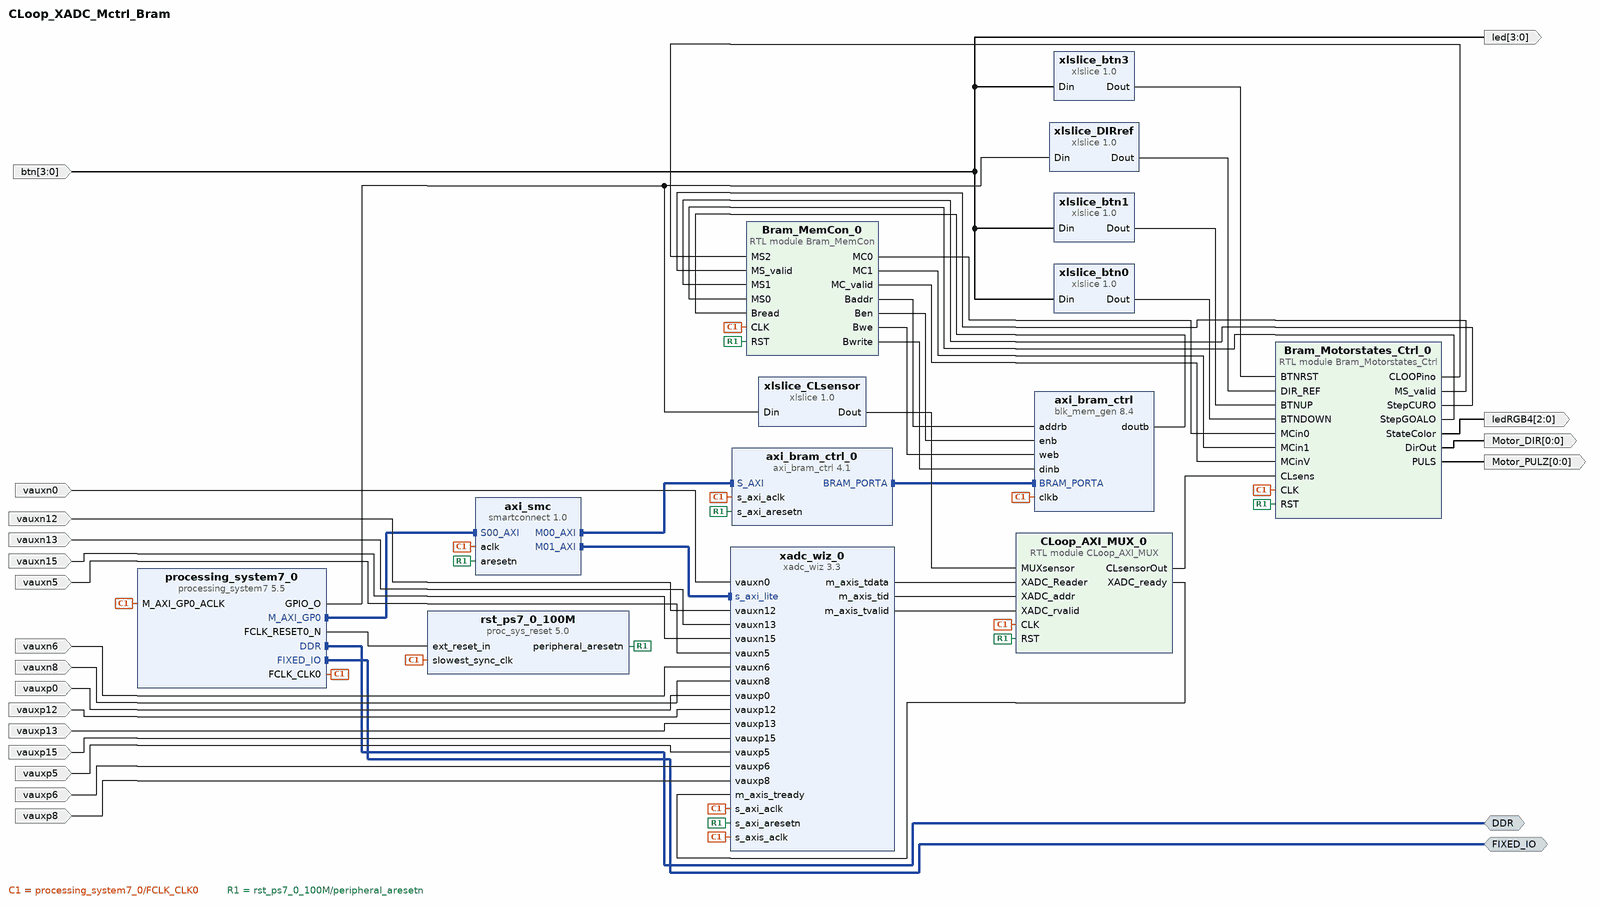
[diagram p0: block diagram of the top level]
# Vivado block design CLoop_XADC_Mctrl_Bram, xc7z020clg400-1, Vivado 2024.1
create_bd_design CLoop_XADC_Mctrl_Bram

create_bd_intf_port -mode Master -vlnv xilinx.com:interface:ddrx_rtl:1.0 DDR
create_bd_intf_port -mode Master -vlnv xilinx.com:display_processing_system7:fixedio_rtl:1.0 FIXED_IO
create_bd_port -dir O -from 0 -to 0 Motor_DIR
create_bd_port -dir O -from 0 -to 0 Motor_PULZ
create_bd_port -dir I -from 3 -to 0 btn
create_bd_port -dir O -from 3 -to 0 led
create_bd_port -dir O -from 2 -to 0 ledRGB4
create_bd_port -dir I vauxn12
create_bd_port -dir I vauxn13
create_bd_port -dir I vauxn5
create_bd_port -dir I vauxp12
create_bd_port -dir I vauxp13
create_bd_port -dir I vauxp5
create_bd_port -dir I vauxn0
create_bd_port -dir I vauxn15
create_bd_port -dir I vauxn6
create_bd_port -dir I vauxn8
create_bd_port -dir I vauxp0
create_bd_port -dir I vauxp15
create_bd_port -dir I vauxp6
create_bd_port -dir I vauxp8

create_bd_cell -type module -reference Bram_MemCon Bram_MemCon_0
create_bd_cell -type module -reference Bram_Motorstates_Ctrl Bram_Motorstates_Ctrl_0
create_bd_cell -type ip -vlnv xilinx.com:ip:blk_mem_gen:8.4 axi_bram_ctrl
set_property -dict {CONFIG.Assume_Synchronous_Clk true CONFIG.Memory_Type True_Dual_Port_RAM} [get_bd_cells axi_bram_ctrl]
create_bd_cell -type ip -vlnv xilinx.com:ip:axi_bram_ctrl:4.1 axi_bram_ctrl_0
set_property -dict [list \
  CONFIG.DATA_WIDTH 32 \
  CONFIG.RD_CMD_OPTIMIZATION 0 \
  CONFIG.SINGLE_PORT_BRAM 1 \
  CONFIG.USE_ECC 0 \
] [get_bd_cells axi_bram_ctrl_0]
create_bd_cell -type ip -vlnv xilinx.com:ip:smartconnect:1.0 axi_smc
set_property -dict {CONFIG.NUM_MI 2 CONFIG.NUM_SI 1} [get_bd_cells axi_smc]
create_bd_cell -type ip -vlnv xilinx.com:ip:processing_system7:5.5 processing_system7_0
set_property -dict [list \
  CONFIG.PCW_APU_PERIPHERAL_FREQMHZ 650 \
  CONFIG.PCW_CRYSTAL_PERIPHERAL_FREQMHZ 50 \
  CONFIG.PCW_ENET0_ENET0_IO {MIO 16 .. 27} \
  CONFIG.PCW_ENET0_GRP_MDIO_ENABLE 1 \
  CONFIG.PCW_ENET0_GRP_MDIO_IO {MIO 52 .. 53} \
  CONFIG.PCW_ENET0_PERIPHERAL_ENABLE 1 \
  CONFIG.PCW_ENET0_RESET_ENABLE 1 \
  CONFIG.PCW_ENET0_RESET_IO {MIO 9} \
  CONFIG.PCW_ENET_RESET_ENABLE 1 \
  CONFIG.PCW_ENET_RESET_SELECT {Share reset pin} \
  CONFIG.PCW_FPGA0_PERIPHERAL_FREQMHZ 100 \
  CONFIG.PCW_FPGA1_PERIPHERAL_FREQMHZ 50 \
  CONFIG.PCW_GPIO_EMIO_GPIO_ENABLE 1 \
  CONFIG.PCW_GPIO_EMIO_GPIO_IO 5 \
  CONFIG.PCW_GPIO_EMIO_GPIO_WIDTH 5 \
  CONFIG.PCW_GPIO_MIO_GPIO_ENABLE 1 \
  CONFIG.PCW_GPIO_MIO_GPIO_IO MIO \
  CONFIG.PCW_I2C_RESET_ENABLE 1 \
  CONFIG.PCW_M_AXI_GP0_FREQMHZ 10 \
  CONFIG.PCW_PERIPHERAL_BOARD_PRESET None \
  CONFIG.PCW_PRESET_BANK1_VOLTAGE {LVCMOS 1.8V} \
  CONFIG.PCW_QSPI_GRP_FBCLK_ENABLE 1 \
  CONFIG.PCW_QSPI_GRP_FBCLK_IO {MIO 8} \
  CONFIG.PCW_QSPI_GRP_SINGLE_SS_ENABLE 1 \
  CONFIG.PCW_QSPI_GRP_SINGLE_SS_IO {MIO 1 .. 6} \
  CONFIG.PCW_QSPI_PERIPHERAL_ENABLE 1 \
  CONFIG.PCW_QSPI_QSPI_IO {MIO 1 .. 6} \
  CONFIG.PCW_SD0_GRP_CD_ENABLE 1 \
  CONFIG.PCW_SD0_GRP_CD_IO {MIO 47} \
  CONFIG.PCW_SD0_GRP_WP_ENABLE 0 \
  CONFIG.PCW_SD0_PERIPHERAL_ENABLE 1 \
  CONFIG.PCW_SD0_SD0_IO {MIO 40 .. 45} \
  CONFIG.PCW_SDIO_PERIPHERAL_FREQMHZ 50 \
  CONFIG.PCW_SINGLE_QSPI_DATA_MODE x4 \
  CONFIG.PCW_UART0_PERIPHERAL_ENABLE 1 \
  CONFIG.PCW_UART0_UART0_IO {MIO 14 .. 15} \
  CONFIG.PCW_UART1_PERIPHERAL_ENABLE 0 \
  CONFIG.PCW_UART_PERIPHERAL_FREQMHZ 100 \
  CONFIG.PCW_UIPARAM_DDR_BUS_WIDTH {16 Bit} \
  CONFIG.PCW_UIPARAM_DDR_FREQ_MHZ 525 \
  CONFIG.PCW_UIPARAM_DDR_PARTNO {MT41J256M16 RE-125} \
  CONFIG.PCW_USB0_PERIPHERAL_ENABLE 1 \
  CONFIG.PCW_USB0_RESET_ENABLE 1 \
  CONFIG.PCW_USB0_RESET_IO {MIO 46} \
  CONFIG.PCW_USB0_USB0_IO {MIO 28 .. 39} \
  CONFIG.PCW_USB_RESET_ENABLE 1 \
  CONFIG.PCW_USB_RESET_SELECT {Share reset pin} \
] [get_bd_cells processing_system7_0]
# 496 more settings of processing_system7_0 are not shown: defaults, MIO pin electricals, DDR timing, and values the tool derives
create_bd_cell -type ip -vlnv xilinx.com:ip:proc_sys_reset:5.0 rst_ps7_0_100M
create_bd_cell -type ip -vlnv xilinx.com:ip:xlslice:1.0 xlslice_CLsensor
set_property -dict {CONFIG.DIN_FROM 4 CONFIG.DIN_TO 1 CONFIG.DIN_WIDTH 5} [get_bd_cells xlslice_CLsensor]
create_bd_cell -type ip -vlnv xilinx.com:ip:xlslice:1.0 xlslice_DIRref
set_property -dict {CONFIG.DIN_FROM 0 CONFIG.DIN_WIDTH 5} [get_bd_cells xlslice_DIRref]
create_bd_cell -type ip -vlnv xilinx.com:ip:xlslice:1.0 xlslice_btn0
set_property -dict {CONFIG.DIN_WIDTH 4} [get_bd_cells xlslice_btn0]
create_bd_cell -type ip -vlnv xilinx.com:ip:xlslice:1.0 xlslice_btn1
set_property -dict {CONFIG.DIN_FROM 1 CONFIG.DIN_TO 1 CONFIG.DIN_WIDTH 4} [get_bd_cells xlslice_btn1]
create_bd_cell -type ip -vlnv xilinx.com:ip:xlslice:1.0 xlslice_btn3
set_property -dict {CONFIG.DIN_FROM 3 CONFIG.DIN_TO 3 CONFIG.DIN_WIDTH 4} [get_bd_cells xlslice_btn3]
create_bd_cell -type module -reference CLoop_AXI_MUX CLoop_AXI_MUX_0
create_bd_cell -type ip -vlnv xilinx.com:ip:xadc_wiz:3.3 xadc_wiz_0
set_property -dict [list \
  CONFIG.CHANNEL_ENABLE_TEMPERATURE true \
  CONFIG.CHANNEL_ENABLE_VAUXP0_VAUXN0 true \
  CONFIG.CHANNEL_ENABLE_VAUXP12_VAUXN12 true \
  CONFIG.CHANNEL_ENABLE_VAUXP13_VAUXN13 true \
  CONFIG.CHANNEL_ENABLE_VAUXP15_VAUXN15 true \
  CONFIG.CHANNEL_ENABLE_VAUXP1_VAUXN1 false \
  CONFIG.CHANNEL_ENABLE_VAUXP5_VAUXN5 true \
  CONFIG.CHANNEL_ENABLE_VAUXP6_VAUXN6 true \
  CONFIG.CHANNEL_ENABLE_VAUXP8_VAUXN8 true \
  CONFIG.CHANNEL_ENABLE_VP_VN false \
  CONFIG.ENABLE_AXI4STREAM true \
  CONFIG.ENABLE_VCCDDRO_ALARM false \
  CONFIG.ENABLE_VCCPAUX_ALARM false \
  CONFIG.ENABLE_VCCPINT_ALARM false \
  CONFIG.EXTERNAL_MUX_CHANNEL VP_VN \
  CONFIG.OT_ALARM false \
  CONFIG.SEQUENCER_MODE Continuous \
  CONFIG.SINGLE_CHANNEL_SELECTION TEMPERATURE \
  CONFIG.USER_TEMP_ALARM false \
  CONFIG.VCCAUX_ALARM false \
  CONFIG.VCCINT_ALARM false \
  CONFIG.XADC_STARUP_SELECTION channel_sequencer \
] [get_bd_cells xadc_wiz_0]

# ---- connections ----

connect_bd_intf_net [get_bd_intf_pins axi_bram_ctrl/BRAM_PORTA] [get_bd_intf_pins axi_bram_ctrl_0/BRAM_PORTA]
connect_bd_intf_net [get_bd_intf_pins axi_smc/M00_AXI] [get_bd_intf_pins axi_bram_ctrl_0/S_AXI]
connect_bd_intf_net [get_bd_intf_pins axi_smc/M01_AXI] [get_bd_intf_pins xadc_wiz_0/s_axi_lite]
connect_bd_intf_net [get_bd_intf_ports DDR] [get_bd_intf_pins processing_system7_0/DDR]
connect_bd_intf_net [get_bd_intf_ports FIXED_IO] [get_bd_intf_pins processing_system7_0/FIXED_IO]
connect_bd_intf_net [get_bd_intf_pins processing_system7_0/M_AXI_GP0] [get_bd_intf_pins axi_smc/S00_AXI]
connect_bd_net [get_bd_pins Bram_MemCon_0/Baddr] [get_bd_pins axi_bram_ctrl/addrb]
connect_bd_net [get_bd_pins Bram_MemCon_0/Ben] [get_bd_pins axi_bram_ctrl/enb]
connect_bd_net [get_bd_pins Bram_MemCon_0/Bwe] [get_bd_pins axi_bram_ctrl/web]
connect_bd_net [get_bd_pins Bram_MemCon_0/Bwrite] [get_bd_pins axi_bram_ctrl/dinb]
connect_bd_net [get_bd_pins Bram_MemCon_0/MC0] [get_bd_pins Bram_Motorstates_Ctrl_0/MCin0]
connect_bd_net [get_bd_pins Bram_MemCon_0/MC1] [get_bd_pins Bram_Motorstates_Ctrl_0/MCin1]
connect_bd_net [get_bd_pins Bram_MemCon_0/MC_valid] [get_bd_pins Bram_Motorstates_Ctrl_0/MCinV]
connect_bd_net [get_bd_pins Bram_Motorstates_Ctrl_0/CLOOPino] [get_bd_pins Bram_MemCon_0/MS2]
connect_bd_net [get_bd_pins Bram_Motorstates_Ctrl_0/DirOut] [get_bd_ports Motor_DIR]
connect_bd_net [get_bd_pins Bram_Motorstates_Ctrl_0/MS_valid] [get_bd_pins Bram_MemCon_0/MS_valid]
connect_bd_net [get_bd_pins Bram_Motorstates_Ctrl_0/PULS] [get_bd_ports Motor_PULZ]
connect_bd_net [get_bd_pins Bram_Motorstates_Ctrl_0/StateColor] [get_bd_ports ledRGB4]
connect_bd_net [get_bd_pins Bram_Motorstates_Ctrl_0/StepCURO] [get_bd_pins Bram_MemCon_0/MS1]
connect_bd_net [get_bd_pins Bram_Motorstates_Ctrl_0/StepGOALO] [get_bd_pins Bram_MemCon_0/MS0]
connect_bd_net [get_bd_pins CLoop_AXI_MUX_0/CLsensorOut] [get_bd_pins Bram_Motorstates_Ctrl_0/CLsens]
connect_bd_net [get_bd_pins CLoop_AXI_MUX_0/XADC_ready] [get_bd_pins xadc_wiz_0/m_axis_tready]
connect_bd_net [get_bd_pins axi_bram_ctrl/doutb] [get_bd_pins Bram_MemCon_0/Bread]
connect_bd_net [get_bd_ports btn] [get_bd_pins xlslice_btn0/Din] [get_bd_pins xlslice_btn1/Din] [get_bd_ports led] [get_bd_pins xlslice_btn3/Din]
connect_bd_net [get_bd_pins processing_system7_0/FCLK_CLK0] \
  [get_bd_pins axi_bram_ctrl_0/s_axi_aclk] [get_bd_pins axi_smc/aclk] [get_bd_pins axi_bram_ctrl/clkb] \
  [get_bd_pins processing_system7_0/M_AXI_GP0_ACLK] [get_bd_pins rst_ps7_0_100M/slowest_sync_clk] \
  [get_bd_pins Bram_MemCon_0/CLK] [get_bd_pins Bram_Motorstates_Ctrl_0/CLK] [get_bd_pins xadc_wiz_0/s_axis_aclk] \
  [get_bd_pins xadc_wiz_0/s_axi_aclk] [get_bd_pins CLoop_AXI_MUX_0/CLK]
connect_bd_net [get_bd_pins processing_system7_0/FCLK_RESET0_N] [get_bd_pins rst_ps7_0_100M/ext_reset_in]
connect_bd_net [get_bd_pins processing_system7_0/GPIO_O] [get_bd_pins xlslice_DIRref/Din] [get_bd_pins xlslice_CLsensor/Din]
connect_bd_net [get_bd_pins rst_ps7_0_100M/peripheral_aresetn] \
  [get_bd_pins axi_bram_ctrl_0/s_axi_aresetn] [get_bd_pins axi_smc/aresetn] [get_bd_pins Bram_MemCon_0/RST] \
  [get_bd_pins Bram_Motorstates_Ctrl_0/RST] [get_bd_pins xadc_wiz_0/s_axi_aresetn] [get_bd_pins CLoop_AXI_MUX_0/RST]
connect_bd_net -net vauxn0_1 [get_bd_ports vauxn0] [get_bd_pins xadc_wiz_0/vauxn0]
connect_bd_net -net vauxn12_1 [get_bd_ports vauxn12] [get_bd_pins xadc_wiz_0/vauxn12]
connect_bd_net -net vauxn13_1 [get_bd_ports vauxn13] [get_bd_pins xadc_wiz_0/vauxn13]
connect_bd_net -net vauxn15_1 [get_bd_ports vauxn15] [get_bd_pins xadc_wiz_0/vauxn15]
connect_bd_net -net vauxn5_1 [get_bd_ports vauxn5] [get_bd_pins xadc_wiz_0/vauxn5]
connect_bd_net -net vauxn6_1 [get_bd_ports vauxn6] [get_bd_pins xadc_wiz_0/vauxn6]
connect_bd_net -net vauxn8_1 [get_bd_ports vauxn8] [get_bd_pins xadc_wiz_0/vauxn8]
connect_bd_net -net vauxp0_1 [get_bd_ports vauxp0] [get_bd_pins xadc_wiz_0/vauxp0]
connect_bd_net -net vauxp12_1 [get_bd_ports vauxp12] [get_bd_pins xadc_wiz_0/vauxp12]
connect_bd_net -net vauxp13_1 [get_bd_ports vauxp13] [get_bd_pins xadc_wiz_0/vauxp13]
connect_bd_net -net vauxp15_1 [get_bd_ports vauxp15] [get_bd_pins xadc_wiz_0/vauxp15]
connect_bd_net -net vauxp5_1 [get_bd_ports vauxp5] [get_bd_pins xadc_wiz_0/vauxp5]
connect_bd_net -net vauxp6_1 [get_bd_ports vauxp6] [get_bd_pins xadc_wiz_0/vauxp6]
connect_bd_net -net vauxp8_1 [get_bd_ports vauxp8] [get_bd_pins xadc_wiz_0/vauxp8]
connect_bd_net [get_bd_pins xadc_wiz_0/m_axis_tdata] [get_bd_pins CLoop_AXI_MUX_0/XADC_Reader]
connect_bd_net [get_bd_pins xadc_wiz_0/m_axis_tid] [get_bd_pins CLoop_AXI_MUX_0/XADC_addr]
connect_bd_net [get_bd_pins xadc_wiz_0/m_axis_tvalid] [get_bd_pins CLoop_AXI_MUX_0/XADC_rvalid]
connect_bd_net -net xlslice_0_Dout [get_bd_pins xlslice_DIRref/Dout] [get_bd_pins Bram_Motorstates_Ctrl_0/DIR_REF]
connect_bd_net -net xlslice_0_Dout1 [get_bd_pins xlslice_CLsensor/Dout] [get_bd_pins CLoop_AXI_MUX_0/MUXsensor]
connect_bd_net [get_bd_pins xlslice_btn0/Dout] [get_bd_pins Bram_Motorstates_Ctrl_0/BTNDOWN]
connect_bd_net [get_bd_pins xlslice_btn1/Dout] [get_bd_pins Bram_Motorstates_Ctrl_0/BTNUP]
connect_bd_net [get_bd_pins xlslice_btn3/Dout] [get_bd_pins Bram_Motorstates_Ctrl_0/BTNRST]
set_property HDL_ATTRIBUTE.BMM_INFO_ADDRESS_SPACE {byte  0x40000000 32 > CLoop_XADC_Mctrl_Bram axi_bram_ctrl} [get_bd_cells axi_bram_ctrl_0]
set_property HDL_ATTRIBUTE.KEEP_HIERARCHY yes [get_bd_cells axi_bram_ctrl_0]
set_property HDL_ATTRIBUTE.BMM_INFO_PROCESSOR {arm > CLoop_XADC_Mctrl_Bram axi_bram_ctrl_0} [get_bd_cells processing_system7_0]
set_property HDL_ATTRIBUTE.KEEP_HIERARCHY yes [get_bd_cells processing_system7_0]

# ---- address map ----
assign_bd_address -offset 0x40000000 -range 8K -target_address_space [get_bd_addr_spaces processing_system7_0/Data] [get_bd_addr_segs axi_bram_ctrl_0/S_AXI/Mem0]
assign_bd_address -offset 0x43C00000 -range 64K -target_address_space [get_bd_addr_spaces processing_system7_0/Data] [get_bd_addr_segs xadc_wiz_0/s_axi_lite/Reg]

validate_bd_design
save_bd_design
